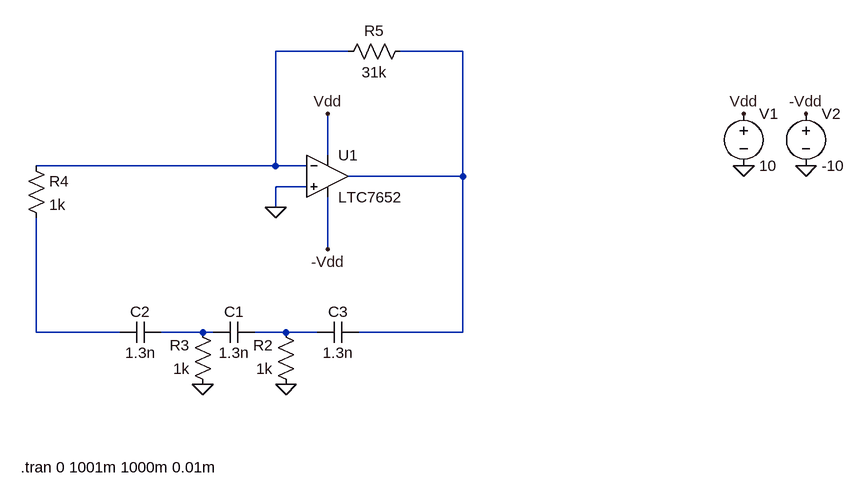
[diagram p0: schematic 1a.asc]
1a.asc, the LTspice schematic file:
Version 4.1
SHEET 1 880 680
WIRE 16 -128 -96 -128
WIRE 192 -128 96 -128
WIRE -16 32 -16 -32
WIRE -96 48 -96 -128
WIRE -96 48 -464 48
WIRE -48 48 -96 48
WIRE 192 64 192 -128
WIRE 192 64 16 64
WIRE -48 80 -96 80
WIRE -96 112 -96 80
WIRE -16 176 -16 96
WIRE -464 304 -464 128
WIRE -336 304 -464 304
WIRE -208 304 -272 304
WIRE -192 304 -208 304
WIRE -80 304 -128 304
WIRE -32 304 -80 304
WIRE 192 304 192 64
WIRE 192 304 32 304
FLAG 624 -32 Vdd
FLAG 720 -32 -Vdd
FLAG 624 48 0
FLAG 720 48 0
FLAG -96 112 0
FLAG -80 384 0
FLAG -208 384 0
FLAG -16 -32 Vdd
FLAG -16 176 -Vdd
SYMBOL voltage 624 -48 R0
SYMATTR InstName V1
SYMATTR Value 10
SYMBOL voltage 720 -48 R0
SYMATTR InstName V2
SYMATTR Value -10
SYMBOL cap -128 288 R90
WINDOW 0 0 32 VBottom 2
WINDOW 3 32 32 VTop 2
SYMATTR InstName C1
SYMATTR Value 1.3n
SYMBOL res -64 400 R180
WINDOW 0 36 76 Left 2
WINDOW 3 36 40 Left 2
SYMATTR InstName R2
SYMATTR Value 1k
SYMBOL cap -272 288 R90
WINDOW 0 0 32 VBottom 2
WINDOW 3 32 32 VTop 2
SYMATTR InstName C2
SYMATTR Value 1.3n
SYMBOL res -192 400 R180
WINDOW 0 36 76 Left 2
WINDOW 3 36 40 Left 2
SYMATTR InstName R3
SYMATTR Value 1k
SYMBOL cap 32 288 R90
WINDOW 0 0 32 VBottom 2
WINDOW 3 32 32 VTop 2
SYMATTR InstName C3
SYMATTR Value 1.3n
SYMBOL res -480 32 R0
SYMATTR InstName R4
SYMATTR Value 1k
SYMBOL res 112 -144 R90
WINDOW 0 0 56 VBottom 2
WINDOW 3 32 56 VTop 2
SYMATTR InstName R5
SYMATTR Value 31k
SYMBOL OpAmps\\LTC7652 -16 0 R0
SYMATTR InstName U1
TEXT -488 512 Left 2 !.tran 0 1001m 1000m 0.01m

The netlist it stands for:
* 1a.asc
V1 Vdd 0 10
V2 -Vdd 0 -10
C1 N005 N004 1.3n
R2 0 N005 1k
C2 N004 N003 1.3n
R3 0 N004 1k
C3 N002 N005 1.3n
R4 N001 N003 1k
R5 N002 N001 31k
X§U1 0 N001 Vdd -Vdd N002 LTC1052  ; LTC7652, pins In+ In- V+ V- OUT
.tran 0 1001m 1000m 0.01m
.backanno
.end